# EAGLE board headstage-64_bga (EAGLE 8.3.2), part 1 of 2
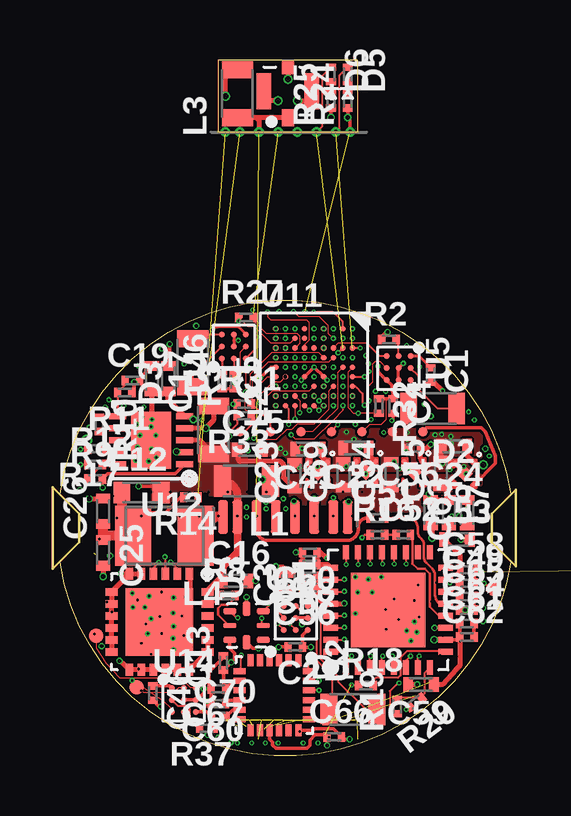
[diagram p5: board, top side]
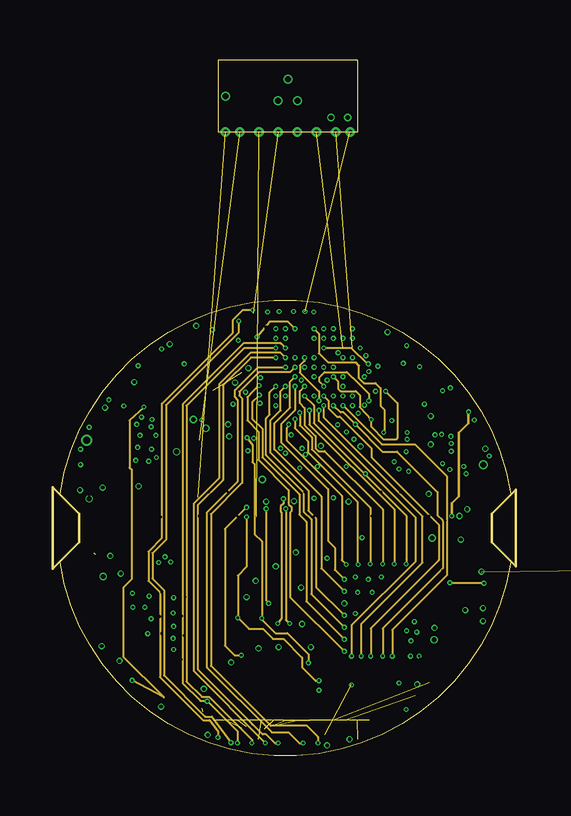
[diagram p6: board, inner layer Route1]
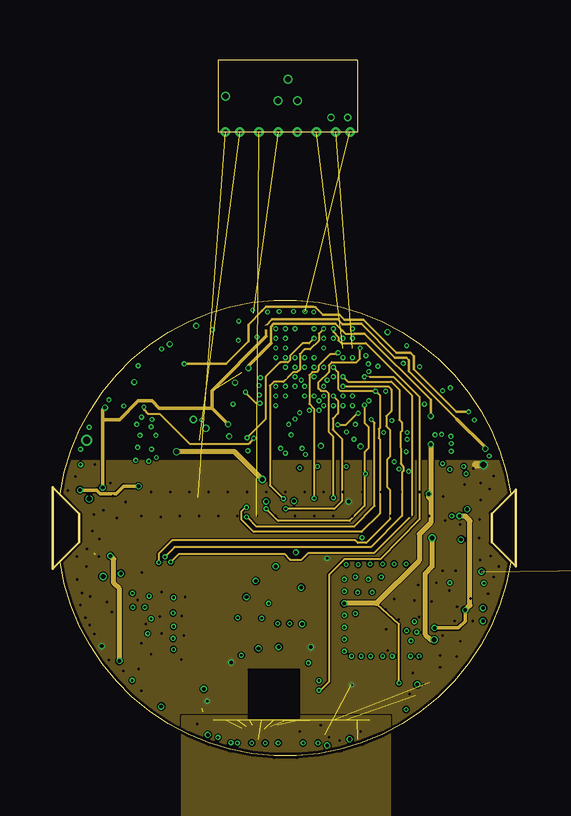
[diagram p7: board, inner layer Route2]
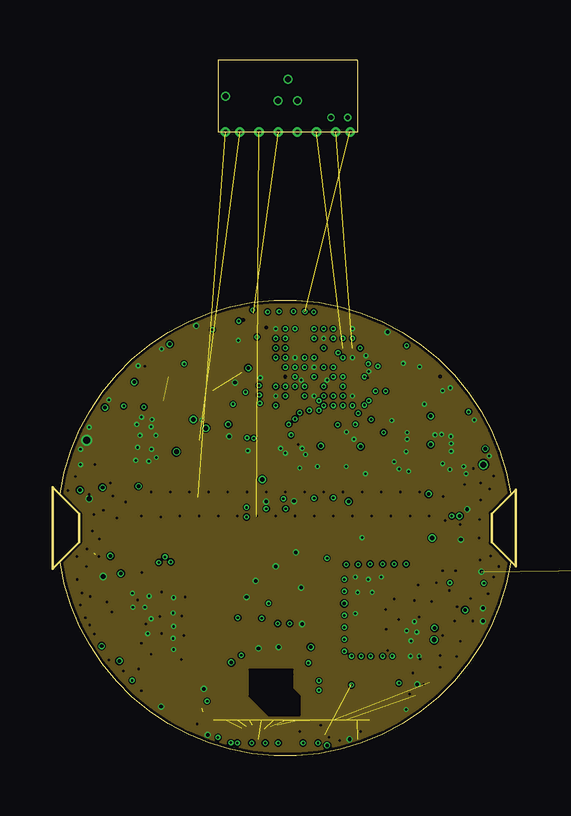
[diagram p8: board, inner layer Route3/GND]
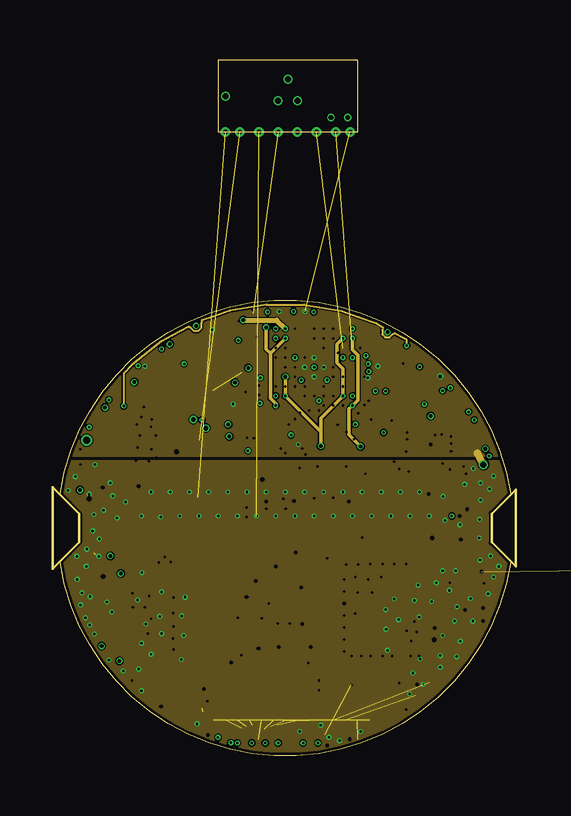
[diagram p9: board, inner layer PWR/AGND]
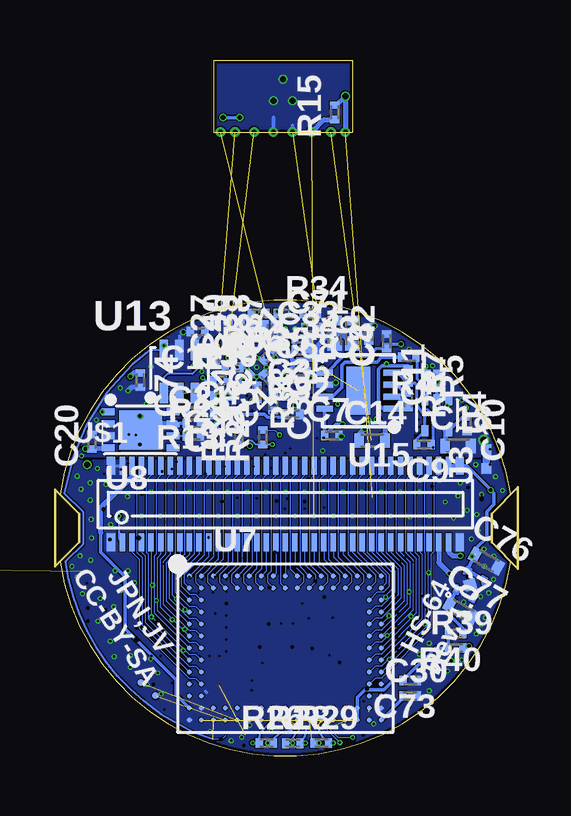
[diagram p10: board, bottom side, seen from below]

Size 18.8 x 28.99 mm. Coordinates in mm from the lower left corner, seen from the top.
Outline: 12.4,25.99 6.6,25.99 6.6,28.99 12.4,28.99 12.4,25.99
Outline: 0,10.89 0.8,10.09 0.8,8.89 0,8.09 arc163 18.8,8.09 18,8.89 18,10.09 18.8,10.89 arc163 0,10.89
Copper layers ((1+2*3+4)*(5+16)): Top 0.036mm / dielectric 4mil / Route1 0.036mm / dielectric 5mil / Route2 0.036mm / dielectric 0.10921875mm / Route3/GND 0.036mm / dielectric 5mil / PWR/AGND 0.036mm / dielectric 4mil / Bottom 0.036mm
Design rules "speedy-6-layer *": minimum track width 2mil, minimum drill 0.1mm, track to track 2mil, track to pad 2mil, pad to pad 2mil, via to via 2mil, smd to smd 2mil, copper to edge 5mil, drill to drill 5mil, minimum pad ring 2mil, minimum via ring 2mil, stop-mask expansion 1mil, vias tented up to drill 20mil, thermal gap 10mil
Net classes: 1 thick: width 0.102 mm
tKeepout: area -0.1,6.6 to 1.4,12.4; area 17.4,6.6 to 18.9,12.4
tRestrict: area -0.1,6.6 to 1.4,12.4; area 17.4,6.6 to 18.9,12.4
Milling: 8 lines

## Footprints (pad centres in the part's own frame; a part is rotated, then mirrored left to right if it is on the bottom)
0201T = smd 0.3 x 0.4: 1 -0.3,0; 2 0.3,0
0402T = smd 0.4 x 0.6: 1 -0.533,0; 2 0.533,0
0805T = smd 0.7 x 1.3: 1 -1,0; 2 1,0
LED-0201T = smd 0.3 x 0.4: 1 -0.3,0; 2 0.3,0
HEADSTAGE64-EDGE-MOUNT_PADS = smd 0.4 x 1.4: 1 -2.6,0; 2 -2,0; 3 -1.2,0; 4 -0.4,0; 5 0.4,0; 6 1.2,0; 7 2,0; 8 2.6,0
HEADSTAGE64-EDGE-MOUNT_CASTELLATED = drill 0.2 pad 0.406: 1 -2.6,0; 2 -2,0; 3 -1.2,0; 4 -0.4,0; 5 0.4,0; 6 1.2,0; 7 2,0; 8 2.6,0
0201_LINK = smd 0.432 x 0.432: 1 -0.394,0; 2 0.394,0
1210T = smd 1.5 x 2.5: 1 -1.3,0; 2 1.3,0
0603T = smd 0.7 x 0.9: 1 -0.82,0; 2 0.82,0
B0.4MM = smd 0.4 x 0.4: TP 0,0
TP06R = smd 0.6 x 0.6: TP 0,0
B0.3MM = smd 0.3 x 0.3: TP 0,0
WLCSP3X3 = smd 0.25 x 0.25: A1 -0.5,0.5; A2 0,0.5; A3 0.5,0.5; B1 -0.5,0; B2 0,0; B3 0.5,0; C1 -0.5,-0.5; C2 0,-0.5; C3 0.5,-0.5
QFN24-3X3_NO-PAD = smd 0.5 x 0.25: 1 -1.45,1; 2 -1.45,0.6; 3 -1.45,0.2; 4 -1.45,-0.2; 5 -1.45,-0.6; 6 -1.45,-1; 13 1.45,-0.2; 14 1.45,-0.6; 15 1.45,-1; 16 1.45,0.2; 17 1.45,0.6; 18 1.45,1 | smd 0.25 x 0.5: 7 -0.2,-1.45; 8 -0.6,-1.45; 9 -1,-1.45; 10 0.2,-1.45; 11 0.6,-1.45; 12 1,-1.45; 19 0.2,1.45; 20 0.6,1.45; 21 1,1.45; 22 -0.2,1.45; 23 -0.6,1.45; 24 -1,1.45
QFN24-4X4 = smd 0.5 x 0.3: 1 -2,1.25; 2 -2,0.75; 3 -2,0.25; 4 -2,-0.25; 5 -2,-0.75; 6 -2,-1.25; 13 2,-1.25; 14 2,-0.75; 15 2,-0.25; 16 2,0.25; 17 2,0.75; 18 2,1.25 | smd 0.3 x 0.5: 7 -1.25,-2; 8 -0.75,-2; 9 -0.25,-2; 10 0.25,-2; 11 0.75,-2; 12 1.25,-2; 19 1.25,2; 20 0.75,2; 21 0.25,2; 22 -0.25,2; 23 -0.75,2; 24 -1.25,2 | smd 2.8 x 2.8: PAD 0,0
PDSO-N5 = smd 0.45 x 0.3: 1 -0.65,0.5; 2 -0.65,0; 3 -0.65,-0.5; 4 0.65,-0.5; 5 0.65,0.5
BGA104_0.5MM = smd 0.2 x 0.2: A1 -4,3; A2 -3.5,3; A3 -3,3; A4 -2.5,3; A5 -2,3; A6 -1.5,3; A7 -1,3; A8 -0.5,3; A9 0,3; A10 0.5,3; A11 1,3; A12 1.5,3; A13 2,3; A14 2.5,3; A15 3,3; A16 3.5,3; A17 4,3; B1 -4,2.5; B2 -3.5,2.5; B3 -3,2.5; B4 -2.5,2.5; B5 -2,2.5; B6 -1.5,2.5; B7 -1,2.5; B8 -0.5,2.5; B9 0,2.5; B10 0.5,2.5; B11 1,2.5; B12 1.5,2.5; B13 2,2.5; B14 2.5,2.5; B15 3,2.5; B16 3.5,2.5; B17 4,2.5; C1 -4,2; C2 -3.5,2; C16 3.5,2; C17 4,2; D1 -4,1.5; D2 -3.5,1.5; D16 3.5,1.5; D17 4,1.5; E1 -4,1; E2 -3.5,1; E16 3.5,1; E17 4,1; F1 -4,0.5; F2 -3.5,0.5; F16 3.5,0.5; F17 4,0.5; G1 -4,0; G2 -3.5,0; G16 3.5,0; G17 4,0; H1 -4,-0.5; H2 -3.5,-0.5; H16 3.5,-0.5; H17 4,-0.5; J1 -4,-1; J2 -3.5,-1; J16 3.5,-1; J17 4,-1; K1 -4,-1.5; K2 -3.5,-1.5; K16 3.5,-1.5; K17 4,-1.5; L1 -4,-2; L2 -3.5,-2; L16 3.5,-2; L17 4,-2; M1 -4,-2.5; M2 -3.5,-2.5; M3 -3,-2.5; M4 -2.5,-2.5; M5 -2,-2.5; M6 -1.5,-2.5; M7 -1,-2.5; M8 -0.5,-2.5; M9 0,-2.5; M10 0.5,-2.5; M11 1,-2.5; M12 1.5,-2.5; M13 2,-2.5; M14 2.5,-2.5; M15 3,-2.5; M16 3.5,-2.5; M17 4,-2.5; N1 -4,-3; N2 -3.5,-3; N3 -3,-3; N4 -2.5,-3; N5 -2,-3; N6 -1.5,-3; N7 -1,-3; N8 -0.5,-3; N9 0,-3; N10 0.5,-3; N11 1,-3; N12 1.5,-3; N13 2,-3; N14 2.5,-3; N15 3,-3; N16 3.5,-3; N17 4,-3
LFCSP8-2X3 = smd 0.55 x 0.3: 1 -1.35,0.75; 2 -1.35,0.25; 3 -1.35,-0.25; 4 -1.35,-0.75; 5 1.35,-0.75; 6 1.35,-0.25; 7 1.35,0.25; 8 1.35,0.75 | smd 1.8 x 1.65: PAD 0,0
X2SON = smd 0.21 x 0.21: 1 -0.45,0.4; 2 -0.45,-0.4; 3 0.45,-0.4; 4 0.45,0.4 | smd 0.48 x 0.48 rotated 45: 5 0,0
VBGA81-4X4 = smd 0.23 x 0.23: A1 1.6,1.6; A2 1.2,1.6; A3 0.8,1.6; A4 0.4,1.6; A5 0,1.6; A6 -0.4,1.6; A7 -0.8,1.6; A8 -1.2,1.6; A9 -1.6,1.6; B1 1.6,1.2; B2 1.2,1.2; B3 0.8,1.2; B4 0.4,1.2; B5 0,1.2; B6 -0.4,1.2; B7 -0.8,1.2; B8 -1.2,1.2; B9 -1.6,1.2; C1 1.6,0.8; C2 1.2,0.8; C3 0.8,0.8; C4 0.4,0.8; C5 0,0.8; C6 -0.4,0.8; C7 -0.8,0.8; C8 -1.2,0.8; C9 -1.6,0.8; D1 1.6,0.4; D2 1.2,0.4; D3 0.8,0.4; D4 0.4,0.4; D5 0,0.4; D6 -0.4,0.4; D7 -0.8,0.4; D8 -1.2,0.4; D9 -1.6,0.4; E1 1.6,0; E2 1.2,0; E3 0.8,0; E4 0.4,0; E5 0,0; E6 -0.4,0; E7 -0.8,0; E8 -1.2,0; E9 -1.6,0; F1 1.6,-0.4; F2 1.2,-0.4; F3 0.8,-0.4; F4 0.4,-0.4; F5 0,-0.4; F6 -0.4,-0.4; F7 -0.8,-0.4; F8 -1.2,-0.4; F9 -1.6,-0.4; G1 1.6,-0.8; G2 1.2,-0.8; G3 0.8,-0.8; G4 0.4,-0.8; G5 0,-0.8; G6 -0.4,-0.8; G7 -0.8,-0.8; G8 -1.2,-0.8; G9 -1.6,-0.8; H1 1.6,-1.2; H2 1.2,-1.2; H3 0.8,-1.2; H4 0.4,-1.2; H5 0,-1.2; H6 -0.4,-1.2; H7 -0.8,-1.2; H8 -1.2,-1.2; H9 -1.6,-1.2; J1 1.6,-1.6; J2 1.2,-1.6; J3 0.8,-1.6; J4 0.4,-1.6; J5 0,-1.6; J6 -0.4,-1.6; J7 -0.8,-1.6; J8 -1.2,-1.6; J9 -1.6,-1.6
DFN103X3 = smd 0.7 x 0.25: 1 -1.4,1; 2 -1.4,0.5; 3 -1.4,0; 4 -1.4,-0.5; 5 -1.4,-1; 6 1.4,-1; 7 1.4,-0.5; 8 1.4,0; 9 1.4,0.5; 10 1.4,1 | smd 1.65 x 2.38: PAD 0,0
SC70 = smd 0.35 x 0.85: 1 -0.65,-0.9; 2 0,-0.9; 3 0.65,-0.9; 4 0.65,0.9; 5 0,0.9; 6 -0.65,0.9
PWSON-N8-3X3 = smd 0.7 x 0.25: 1 -1.4,0.75; 2 -1.4,0.25; 3 -1.4,-0.25; 4 -1.4,-0.75; 5 1.4,-0.75; 6 1.4,-0.25; 7 1.4,0.25; 8 1.4,0.75 | smd 1 x 2: PAD 0,0
WQFN32-5X5 = smd 0.25 x 0.6: 1 1.75,2.4; 2 1.25,2.4; 3 0.75,2.4; 4 0.25,2.4; 5 -0.25,2.4; 6 -0.75,2.4; 7 -1.25,2.4; 8 -1.75,2.4; 17 -1.75,-2.4; 18 -1.25,-2.4; 19 -0.75,-2.4; 20 -0.25,-2.4; 21 0.25,-2.4; 22 0.75,-2.4; 23 1.25,-2.4; 24 1.75,-2.4 | smd 0.6 x 0.25: 9 -2.4,1.75; 10 -2.4,1.25; 11 -2.4,0.75; 12 -2.4,0.25; 13 -2.4,-0.25; 14 -2.4,-0.75; 15 -2.4,-1.25; 16 -2.4,-1.75; 25 2.4,-1.75; 26 2.4,-1.25; 27 2.4,-0.75; 28 2.4,-0.25; 29 2.4,0.25; 30 2.4,0.75; 31 2.4,1.25; 32 2.4,1.75 | smd 3.1 x 3.1: PAD 0,0
UQFN = smd 0.55 x 0.25: P$1 -0.7,0.6; P$3 -0.7,-0.6; P$5 0.7,-0.6; P$7 0.7,0.6 | smd 0.55 x 0.2: P$2 -0.7,0; P$6 0.7,0 | smd 0.3 x 0.6: P$4 0,-0.7; P$8 0,0.7
DF40-70HEAD = smd 0.23 x 0.75: 1 -6.8,-1.585; 2 -6.4,-1.585; 3 -6,-1.585; 4 -5.6,-1.585; 5 -5.2,-1.585; 6 -4.8,-1.585; 7 -4.4,-1.585; 8 -4,-1.585; 9 -3.6,-1.585; 10 -3.2,-1.585; 11 -2.8,-1.585; 12 -2.4,-1.585; 13 -2,-1.585; 14 -1.6,-1.585; 15 -1.2,-1.585; 16 -0.8,-1.585; 17 -0.4,-1.585; 18 0,-1.585; 19 0.4,-1.585; 20 0.8,-1.585; 21 1.2,-1.585; 22 1.6,-1.585; 23 2,-1.585; 24 2.4,-1.585; 25 2.8,-1.585; 26 3.2,-1.585; 27 3.6,-1.585; 28 4,-1.585; 29 4.4,-1.585; 30 4.8,-1.585; 31 5.2,-1.585; 32 5.6,-1.585; 33 6,-1.585; 34 6.4,-1.585; 35 6.8,-1.585; 36 6.8,1.585; 37 6.4,1.585; 38 6,1.585; 39 5.6,1.585; 40 5.2,1.585; 41 4.8,1.585; 42 4.4,1.585; 43 4,1.585; 44 3.6,1.585; 45 3.2,1.585; 46 2.8,1.585; 47 2.4,1.585; 48 2,1.585; 49 1.6,1.585; 50 1.2,1.585; 51 0.8,1.585; 52 0.4,1.585; 53 0,1.585; 54 -0.4,1.585; 55 -0.8,1.585; 56 -1.2,1.585; 57 -1.6,1.585; 58 -2,1.585; 59 -2.4,1.585; 60 -2.8,1.585; 61 -3.2,1.585; 62 -3.6,1.585; 63 -4,1.585; 64 -4.4,1.585; 65 -4.8,1.585; 66 -5.2,1.585; 67 -5.6,1.585; 68 -6,1.585; 69 -6.4,1.585; 70 -6.8,1.585 | smd 0.35 x 0.75: M1 -7.275,-1.585; M2 7.275,-1.585; M3 7.275,1.585; M4 -7.275,1.585
X_FL_R_SMT_1(02) = smd 0.5 x 0.7: P$1 0,-1.1 | smd 0.6 x 1.5: P$2 -1,0; P$4 1,0 | smd 0.5 x 0.6: P$3 0,1

## Placement (x,y rotation side)
C1  1uF  [0201T]  15.46,15.87 270 top
C2  0.1uF  [0201T]  9.81,4.54 180 top
C3  1uF  [0201T]  9.62,7.27 90 top
C4  0.1uF  [0201T]  13.9,14.57 270 top
C5  1uF  [0201T]  6.78,15.59 270 top
C6  0.1uF  [0201T]  5.92,17.57 90 bottom
C7  0.1uF  [0201T]  7.46,13.35 0 bottom
C8  0.1uF  [0201T]  5.18,17.27 90 bottom
C9  470pF  [0201T]  3.62,12.97 180 bottom
C10  0.1uF  [0201T]  1.82,13.81 270 bottom
C11  0.1uF  [0201T]  3.02,15.63 90 bottom
C12  0.1uF  [0201T]  13.06,17.67 180 bottom
C13  0.1uF  [0201T]  6.82,3.87 90 top
C14  1uF  [0402T]  5.78,13.13 0 bottom
C15  1uF  [0402T]  15.88,11.77 90 top
C16  1uF  [0402T]  7.32,7.29 0 top
C17  0.22uF  [0402T]  3.84,15.71 270 top
C18  0.22uF  [0402T]  2.2,12.91 0 bottom
C19  10pF  [0201T]  3.02,15.63 0 top
C20  0.1uF  [0201T]  17.47,13.09 90 bottom
C21  0.1uF  [0201T]  13.24,13.85 0 bottom
C22  10uF  [0402T]  12.34,12.82 180 top
C23  1uF  [0402T]  9.78,11.67 90 top
C24  10uF  [0402T]  16.44,12.9 180 top
C25  4.7uF  [0402T]  1.8,8.45 270 top
C26  0.1uF  [0402T]  1.8,10.19 90 top
C27  10nF  [0201T]  11.8,17.69 90 bottom
C28  47nF  [0201T]  11.1,16.69 135 bottom
C29  4.7nF  [0201T]  12.1,14.99 180 bottom
C30  10nF  [0201T]  4.2,2.49 0 bottom
C31  4.7nF  [0201T]  10.1,16.69 45 bottom
C32  4.7nF  [0201T]  9.1,14.23 0 bottom
C33  22nF  [0201T]  8.7,17.39 0 bottom
C34  47nF  [0201T]  8.7,16.89 0 bottom
C35  2.2nF  [0201T]  9.1,14.99 0 bottom
C36  0.1uF  [0201T]  9.9,14.69 270 bottom
C37  4.7nF  [0201T]  9.8,17.69 90 bottom
C38  10nF  [0201T]  10.3,17.69 90 bottom
C39  22nF  [0201T]  10.8,17.69 90 bottom
C40  0.47uF  [0201T]  11.3,17.69 90 bottom
C41  22uF  [0402T]  10.34,12.78 180 top
C42  10uF  [0402T]  7.34,17.61 270 bottom
C43  10nF  [0201T]  10.1,15.69 315 bottom
C44  22nF  [0201T]  11.08,15.69 225 bottom
C45  0.47uF  [0201T]  11.6,16.19 180 bottom
C46  1uF  [0201T]  3.88,2.61 270 top
C47  10nF  [0201T]  12.1,14.23 180 bottom
C48  0.1uF  [0201T]  10.42,7.97 180 top
C49  10nF  [0201T]  16.97,7.19 0 top
C50  10nF  [0201T]  10.42,8.47 180 top
C51  0.1uF  [0201T]  13.24,9.91 0 top
C52  47nF  [0201T]  14.32,9.21 0 top
C53  22uF  [0402T]  16.56,9.01 0 top
C54  1uF  [0402T]  13.82,11.71 90 top
C55  1uF  [0201T]  14.74,12.81 180 top
C56  0.1uF  [0201T]  10.42,7.01 180 top
C57  10nF  [0201T]  10.42,7.48 180 top
C58  0.1uF  [0201T]  16.97,7.75 0 top
C59  4.7uF  [0402T]  15.06,2.97 180 top
C60  0.1uF  [0201T]  6.6,2.17 180 top
C61  0.1uF  [0201T]  16.97,5.51 0 top
C62  10nF  [0201T]  16.97,4.95 0 top
C63  4.7uF  [0402T]  16.98,10.13 90 top
C64  0.1uF  [0201T]  16.97,6.07 0 top
C65  10nF  [0201T]  16.97,6.63 0 top
C66  10nF  [0201T]  11.44,0.79 0 top
C67  0.1uF  [0201T]  6.6,2.79 180 top
C68  1uF  [0201T]  8.8,15.99 0 bottom
C69  1uF  [0402T]  11.82,11.71 90 top
C70  0.1uF  [0201T]  6.62,1.63 0 top
C71  22nF  [0201T]  8.3,17.85 0 bottom
C72  0.47uF  [0201T]  12.34,16.67 270 bottom
C73  0.1uF  [0201T]  4.19,3.14 180 bottom
C74  1uF  [0201T]  15.44,15.65 270 bottom
C75  1uF  [0402T]  7.92,12.75 0 top
C76  1uF  [0402T]  1.02,8.12 330.9 bottom
C77  10uF  [0402T]  2.09,6.06 330.9 bottom
D1  [0805T]  12.22,1.93 0 top
D2  [0805T]  15.54,14.47 180 top
D3  [0805T]  5.54,16.37 90 top
D4  VSKY05401006  [0402T]  4.52,15.71 270 top
D5  XZVGR155W  [LED-0201T]  12,28.39 270 top
D6  XZVGR155W  [LED-0201T]  11.3,28.39 270 top
J1  HEADSTAGE64_EDGE-MOUNT  [HEADSTAGE64-EDGE-MOUNT_PADS]  9.4,9.95 0 top
J2  HEADSTAGE64_EDGE-MOUNT_CASTELLATED  [HEADSTAGE64-EDGE-MOUNT_CASTELLATED]  9.5,25.99 0 top
J3  GND_LINK_0201  [0201_LINK]  1.02,12.37 90 bottom
L1  MLZ2012M100WT000  [0805T]  7.78,11.45 180 top
L2  MLZ2012M100WT000  [0805T]  6.4,13.57 270 top
L3  CIG21L4R7MNE  [0805T]  7.4,27.59 90 top
L4  CBC3225T101MR  [1210T]  4.36,9.17 180 top
L5  BLM15PX601SN1D  [0402T]  6.62,17.61 90 bottom
L6  BLM15PX601SN1D  [0402T]  15.46,10.13 270 top
L7  BLM15PX601SN1D  [0402T]  16.22,10.13 270 top
L12  BLM18KG601SN1D  [0603T]  3.4,10.97 0 top
R1  15k  [0201T]  9.1,7.27 270 top
R2  15k  [0201T]  13.72,17.35 0 top
R3  15k  [0201T]  7.28,15.59 90 top
R4  10k  [0201T]  4.26,16.61 180 bottom
R5  10k  [0201T]  3.54,15.63 270 bottom
R6  5.49k  [0201T]  4.28,14.81 270 bottom
R7  220  [0201T]  4.28,15.83 270 bottom
R8  600  [0201T]  7,6.67 0 top
R9  1M  [0201T]  1.47,11.53 0 top
R10  83.3k  [0201T]  1.64,13.81 270 top
R11  1M  [0201T]  2.7,15.13 180 top
R12  90.9k  [0201T]  1.47,12.13 0 top
R13  50  [0201T]  13.24,14.35 180 bottom
R14  1k  [0201T]  5.46,10.77 180 top
R15  1k  [0201T]  7.34,26.81 90 bottom
R16  49.9  [0201T]  13.24,9.21 0 top
R17  10k  [0201T]  1.47,12.79 180 top
R18  10k  [0201T]  12.76,2.93 0 top
R19  10k  [0201T]  14.06,2.05 90 top
R20  100k  [0201T]  14.84,2.23 216.8 top
R21  4.7k  [0201T]  10.34,13.27 90 bottom
R22  4.7k  [0201T]  11.34,13.27 90 bottom
R23  10k  [0201T]  13.24,13.33 0 bottom
R24  2k  [0201T]  12,27.29 90 top
R25  2k  [0201T]  11.3,27.29 90 top
R26  100  [0201T]  10.19,0.53 0 bottom
R27  100  [0201T]  7.76,18.27 0 top
R28  100  [0201T]  9.09,0.52 0 bottom
R29  100  [0201T]  7.9,0.53 0 bottom
R30  10k  [0201T]  12.12,15.63 0 bottom
R31  10k  [0201T]  7.68,14.65 0 top
R32  10k  [0201T]  13.3,14.57 270 top
R33  1k  [0201T]  7.68,14.17 180 top
R34  10k  [0201T]  8.36,18.43 0 bottom
R35  10k  [0201T]  9.44,18.43 180 bottom
R36  10k  [0201T]  10.52,18.43 180 bottom
R37  15k  [0201T]  6.12,1.15 180 top
R38  10k  [0201T]  10.6,15.13 270 bottom
R39  0 (DNP)  [0201T]  2.3,4.49 0 bottom
R40  0  [0201T]  2.3,5.09 180 bottom
TP1  VCC  [B0.4MM]  13.87,13.5 270 top
TP2  gnd  [B0.4MM]  12.6,13.5 270 top
TP3  [B0.4MM]  10.06,13.5 270 top
TP4  [B0.4MM]  11.33,13.5 270 top
TP5  [B0.4MM]  7.52,13.5 270 top
TP6  [B0.4MM]  8.79,13.5 270 top
TP7  [TP06R]  18.08,6.95 0 top
TP8  VCC  [B0.3MM]  15.41,3.05 0 bottom
TP9  [TP06R]  1.52,5.01 0 top
TP10  VCC  [B0.3MM]  14.82,2.51 0 bottom
TP11  [TP06R]  3.2,2.85 0 top
TP12  [B0.4MM]  15.14,13.5 0 top
U1  TS4231  [WLCSP3X3]  9.84,5.75 0 top
U2  MPU9250_QFN_NO-PAD  [QFN24-3X3_NO-PAD]  8.94,2.52 270 top
U3  CAT4016_QFN  [QFN24-4X4]  4.15,5.58 270 top
U4  OPA170  [PDSO-N5]  3.08,14.19 270 bottom
U5  TS4231  [WLCSP3X3]  14.12,16.15 270 top
U6  TS4231  [WLCSP3X3]  7.26,17.06 90 top
U7  [BGA104_0.5MM]  9.4,4.49 0 bottom
U8  ADG1401  [LFCSP8-2X3]  15.44,13.58 0 bottom
U9  TLV70725  [X2SON]  12.76,11.81 270 top
U10  TLV70718  [X2SON]  14.76,11.81 270 top
U11  10M08DC  [VBGA81-4X4]  10.6,16.19 0 top
U12  LT3463  [DFN103X3]  3.8,13.15 180 top
U13  DAC5311  [SC70]  13.82,16.01 0 bottom
U14  TS4231  [WLCSP3X3]  5.16,2.33 0 top
U15  INA826  [PWSON-N8-3X3]  6.36,15.21 180 bottom
U16  TLV70733  [X2SON]  1.69,7.12 60.9 bottom
U17  TLV70712  [X2SON]  10.76,11.79 270 top
U18  TLV70733  [X2SON]  16.88,11.75 270 top
U19  DS90UB913A_WQFN  [WQFN32-5X5]  13.69,6.08 180 top
U25  TPL0501_UQFN  [UQFN]  7.78,5.43 180 top
U$1  [DF40-70HEAD]  9.4,10.49 0 bottom
X1  X.FL-R-SMT-1  [X_FL_R_SMT_1(02)]  9.5,27.69 0 top